# Altium schematic sheet HDMI.SchDoc
size A3; PageSetup: Record=PageOptions|CenterHorizontal=True|CenterVertical=True|PrintScale=0.73|XCorrection=1.00|YCorrection=1.00|PrintKind=0|BorderSize=5000000|LeftOffset=0|BottomOffset=0|Orientation=2|PaperLength=1000|PaperWidth=1000|Scale=100|PaperSource=7|PrintQuality=-4|MediaType=1|DitherType=10|PaperKind=A4|PrintScaleMode=1; Date: 27.05.2014; DrawnBy: luths8; Organization: BFH; Address1: Bern University of Applied Sciences; Address2: Engineering and Information Technology; Address3: Jlcoweg 1; Address4: CH-3400 Burgdorf; DocumentNumber: 1; Revision: 1.0; SheetNumber: 14; SheetTotal: 19; CurrentDate: 27.05.2014
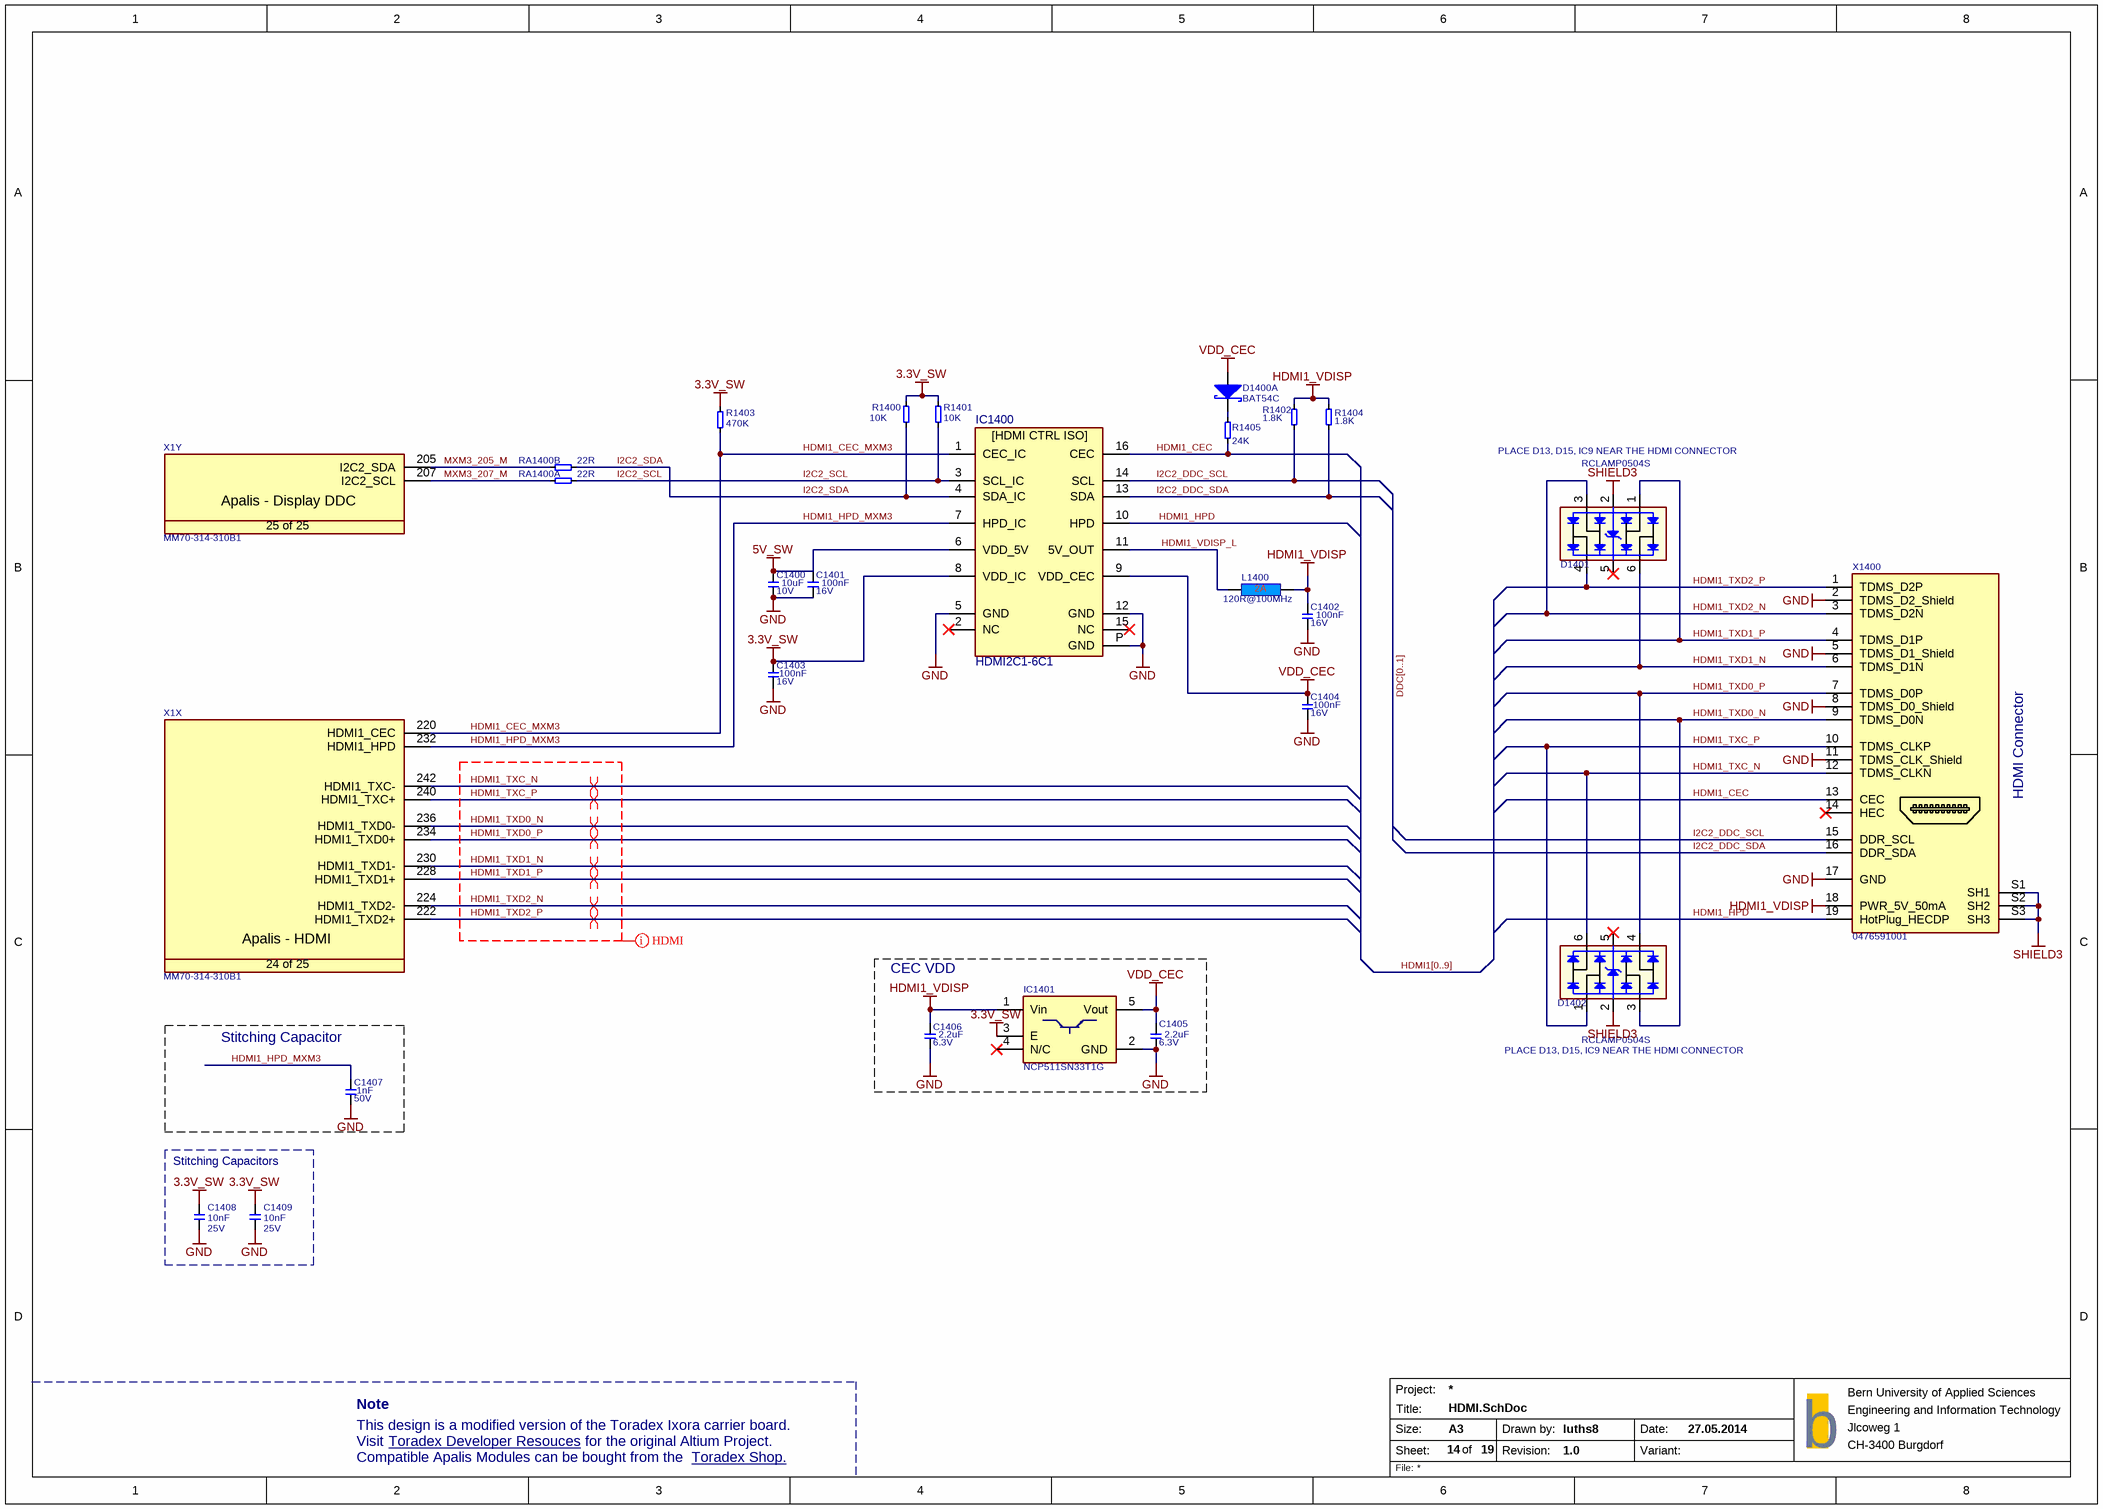
[diagram p0: HDMI.SchDoc]

## Parts
C1400  Rating: 10V  [SMD0603CAP]  (hidden comment: 10uF)
C1401  Rating: 16V  [SMD0603CAP]  (hidden comment: 100nF)
C1402  Rating: 16V  [SMD0603CAP]  (hidden comment: 100nF)
C1403  Rating: 16V  [SMD0603CAP]  (hidden comment: 100nF)
C1404  Rating: 16V  [SMD0603CAP]  (hidden comment: 100nF)
C1405  Rating: 6.3V  [SMD0603CAP]  (hidden comment: 2.2uF)
C1406  Rating: 6.3V  [SMD0603CAP]  (hidden comment: 2.2uF)
C1407  Rating: 50V  [SMD0603CAP]  (hidden comment: 1nF)
C1408  10nF  Rating: 25V  [SMD0603CAP]
C1409  10nF  Rating: 25V  [SMD0603CAP]
D1400  BAT54C  [SOT95P230X110-3N]  (part A of 2)
D1401  RCLAMP0504S  [T_SOT95P285X90-6N]
D1402  RCLAMP0504S  [T_SOT95P285X90-6N]
IC1400  HDMI2C1-6C1  [DFN16]
IC1401  NCP511SN33T1G  [SOT95P279X142-5N]
L1400  120R@100MHz  [INDC1608X95N]
R1400  10K  [SMD0603RES]
R1401  10K  [SMD0603RES]
R1402  1.8K  [SMD0603RES]
R1403  470K  [SMD0603RES]
R1404  1.8K  [SMD0603RES]
R1405  24K  [SMD0603RES]
RA1400  22R  [T_Resistor_Array_X4]  (parts A,B of 4)
X1  Manufacturer Part No.: MM70-314-310B1  [T_JAE_MM70-314-310B1]  (hidden comment: CON-JAE-MM70-314-310B1-314-0.5mm)  (parts X,Y of 25)
X1400  0476591001  [0476591001]

## Blocks framed on the sheet
CEC VDD: C1405 C1406 IC1401
Stitching Capacitor: C1407
Stitching Capacitors: C1408 C1409

## Nets
3.3V_SW: C1403.2 C1408.2 C1409.2 IC1400.8(VDD_IC) IC1401.3(E) R1400.2 R1401.2 R1403.2
5V_SW: C1400.2 C1401.1 IC1400.6(VDD_5V)
GND: C1400.1 C1401.2 C1402.1 C1403.1 C1404.1 C1405.1 C1406.1 C1407.1 C1408.1 C1409.1 IC1400.5(GND) IC1400.12(GND) IC1400.P(GND) IC1401.2(GND) X1400.2(TDMS_D2_Shield) X1400.5(TDMS_D1_Shield) X1400.8(TDMS_D0_Shield) X1400.11(TDMS_CLK_Shield) X1400.17(GND)
HDMI1_VDISP: C1402.2 C1406.2 IC1401.1(Vin) L1400.2 R1402.2 R1404.2 X1400.18(PWR_5V_50mA)
SHIELD3: D1401.2 D1402.2 X1400.S1(SH1) X1400.S2(SH2) X1400.S3(SH3)
VDD_CEC: C1404.2 C1405.2 D1400.1 IC1400.9(VDD_CEC) IC1401.5(Vout)
HDMI1_CEC: IC1400.16(CEC) R1405.1 X1400.13(CEC)
HDMI1_CEC_MXM3: IC1400.1(CEC_IC) R1403.1 X1.220(HDMI1_CEC)
HDMI1_HPD: IC1400.10(HPD) X1400.19(HotPlug_HECDP)
HDMI1_HPD_MXM3: C1407.2 IC1400.7(HPD_IC) X1.232(HDMI1_HPD)
HDMI1_TXC_N: D1402.6 X1.242(HDMI1_TXC-) X1400.12(TDMS_CLKN)
HDMI1_TXC_P: D1402.1 X1.240(HDMI1_TXC+) X1400.10(TDMS_CLKP)
HDMI1_TXD0_N: D1402.3 X1.236(HDMI1_TXD0-) X1400.9(TDMS_D0N)
HDMI1_TXD0_P: D1402.4 X1.234(HDMI1_TXD0+) X1400.7(TDMS_D0P)
HDMI1_TXD1_N: D1401.6 X1.230(HDMI1_TXD1-) X1400.6(TDMS_D1N)
HDMI1_TXD1_P: D1401.1 X1.228(HDMI1_TXD1+) X1400.4(TDMS_D1P)
HDMI1_TXD2_N: D1401.3 X1.224(HDMI1_TXD2-) X1400.3(TDMS_D2N)
HDMI1_TXD2_P: D1401.4 X1.222(HDMI1_TXD2+) X1400.1(TDMS_D2P)
HDMI1_VDISP_L: IC1400.11(5V_OUT) L1400.1
I2C2_DDC_SCL: IC1400.14(SCL) R1402.1 X1400.15(DDR_SCL)
I2C2_DDC_SDA: IC1400.13(SDA) R1404.1 X1400.16(DDR_SDA)
I2C2_SCL: IC1400.3(SCL_IC) R1401.1 RA1400.5
I2C2_SDA: IC1400.4(SDA_IC) R1400.1 RA1400.6
MXM3_205_M: RA1400.2 X1.205(I2C2_SDA)
MXM3_207_M: RA1400.1 X1.207(I2C2_SCL)
NetD1400_3: D1400.3 R1405.2

Not connected (* = marked no-connect by the designer): D1401 5*; D1402 5*; IC1400 2(NC)* 15(NC)*; IC1401 4(N/C)*; X1400 14(HEC)*

## Buses and harness runs
bus DDC[0..1]
bus HDMI1[0..9]

## Layout directives
differential pair: HDMI1_TXC_N, HDMI1_TXC_P, HDMI1_TXD0_N, HDMI1_TXD0_P, HDMI1_TXD1_N, HDMI1_TXD1_P, HDMI1_TXD2_N, HDMI1_TXD2_P
net class HDMI: HDMI1_TXC_N, HDMI1_TXC_P, HDMI1_TXD0_N, HDMI1_TXD0_P, HDMI1_TXD1_N, HDMI1_TXD1_P, HDMI1_TXD2_N, HDMI1_TXD2_P

## Notes on the sheet
- (near D1401) PLACE D13, D15, IC9 NEAR THE HDMI CONNECTOR
- (near X1400) HDMI Connector
- (near D1402) PLACE D13, D15, IC9 NEAR THE HDMI CONNECTOR
- Note
- This design is a modified version of the Toradex Ixora carrier board.
- Visit
- Compatible Apalis Modules can be bought from the
- Toradex Developer Resouces <https://developer.toradex.com/products/ixora-carrier-board>
- for the original Altium Project.
- Toradex Shop. <https://www.toradex.com/order-now/apalis-arm-family>
- Project:
- Size:
- Sheet:
- Title:
- A3
- of
- Drawn by:
- Revision:
- Date:
- Variant:
- b
- File:
- (in symbol CON-JAE-MM70-314-310B1-314-0.5mm, part X) Apalis - HDMI; 24 of 25
- (in symbol CON-JAE-MM70-314-310B1-314-0.5mm, part Y) Apalis - Display DDC; 25 of 25
- (in symbol HDMI2C1-6C1) [HDMI CTRL ISO]

## Library data of the parts
C1400 = C-X5R-10uF-10V-20%-0603: Capacitor Ceramic X5R 10uF 10V 20% 0603; Tolerance: 20%; Type: X5R; Value: 10uF
C1401-C1404 = C-X7R-100nF-16V-10%-0402: Capacitor Ceramic X7R 100nF 16V 10% 0603; Tolerance: 10%; Type: X7R; Value: 100nF
C1405 C1406 = C-X5R-2.2uF-6.3V-20%-0603: Capacitor Ceramic X5R 2.2uF 6.3V 20% 0603; Tolerance: 20%; Type: X5R; Value: 2.2uF
C1407 = C-X7R-1nF-50V-10%-0402: Capacitor Ceramic X7R 1nF 50V 10% 0603; Tolerance: 10%; Type: X7R; Value: 1nF
C1408 C1409 = C-X7R-10nF-25V-10%-0603: Capacitor Ceramic X7R 10nF 25V 10% 0603; Tolerance: 10%; Type: X7R; Value: 10nF
D1400 = D-Philips-BAT54C-Schottky-30V-200mA: BAT54 Schottky Diode; Manufacturer: Philips; Manufacturer Part Number: BAT54C
D1401 D1402 = D-Semtech-RClamp0504S: TVS Array low cap; Manufacturer Name: Semtech; Manufacturer Part No.: RCLAMP0504S
IC1400 = HDMI2C1-6C1: HDMI ESD protection, level shifter and backdrive protection; Manufacturer Name: STMicroelectronics
IC1401 = IC-ON-NCP511SN33T1G: NCP511SN33T1G LDO Regulator; Manufacturer Name: ON Semiconductor; Manufacturer Part No.: NCP511SN33T1G
L1400 = L-120R@100MHz-2A-25%-0603: 120R@100MHz 2A EMI FILTER; Tolerance: 25%; Rating: 2A; Value: 120R@100MHz
R1400 R1401 = R-10KR-63mW-1%-0603: Resistor 10 Kohm 63mW 1% 0603; Value: 10KR; Rating: 63mW; Tolerance: 1%
R1402 R1404 = R-1.8KR-63mW-5%-0603: Resistor 1.8 Kohm 63mW 5% 0603; Value: 1.8KR; Rating: 63mW; Tolerance: 5%
R1403 = R-470KR-63mW-5%-0402: Resistor 470 Kohm 63mW 5% 0603; Value: 470KR; Rating: 63mW; Tolerance: 5%
R1405 = R-24KR-63mW-1%-0402: Resistor 24 Kohm 63mW 1% 0603; Value: 24KR; Rating: 63mW; Tolerance: 1%
RA1400 = RA-22R-63mW-5%-1206-div: Resistor Array 22 R 63mW 5% 1206; Tolerance: 5%; Power Dissipation: 63mW; Value: 22R
X1 = CON-JAE-MM70-314-310B1-314-0.5mm: MXM3 Connector; Manufacturer Name: JAE; No. of ways: 314
X1400 = CON-Molex-0476591001: HDMI Connector Vertical; Manufacturer: Molex; Manufacturer Part No.: 0476591001; System: Connector